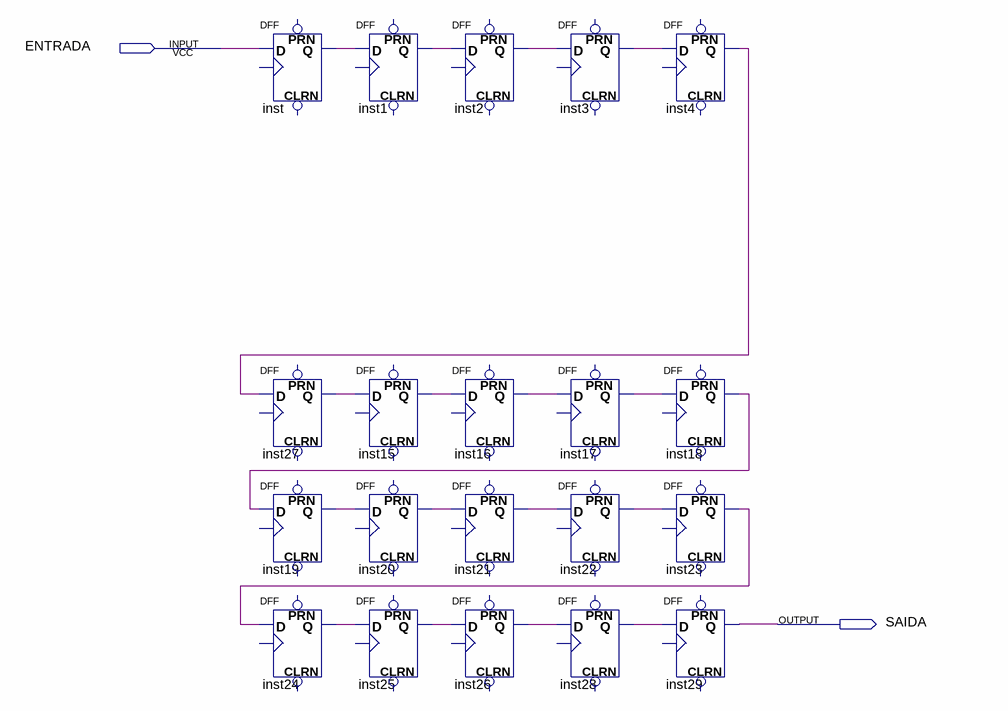
[diagram p0: schematic sheet]
// Quartus schematic temporizador.bdf as structural Verilog: 20 symbols, 2 pins
module temporizador (
  input  ENTRADA,
  output SAIDA
);

  wire inst1_q, inst2_q, inst3_q, inst4_q, inst15_q, inst16_q, inst17_q, inst18_q, inst19_q, inst20_q,
       inst21_q, inst22_q, inst23_q, inst24_q, inst25_q, inst26_q, inst27_q, inst28_q, inst_q;

  DFF inst (.D(ENTRADA), .Q(inst_q));  // open: CLRN, CLK, PRN
  DFF inst27 (.D(inst4_q), .Q(inst27_q));  // open: CLRN, CLK, PRN
  DFF inst19 (.D(inst18_q), .Q(inst19_q));  // open: CLRN, CLK, PRN
  DFF inst24 (.D(inst23_q), .Q(inst24_q));  // open: CLRN, CLK, PRN
  DFF inst1 (.D(inst_q), .Q(inst1_q));  // open: CLRN, CLK, PRN
  DFF inst15 (.D(inst27_q), .Q(inst15_q));  // open: CLRN, CLK, PRN
  DFF inst20 (.D(inst19_q), .Q(inst20_q));  // open: CLRN, CLK, PRN
  DFF inst25 (.D(inst24_q), .Q(inst25_q));  // open: CLRN, CLK, PRN
  DFF inst2 (.D(inst1_q), .Q(inst2_q));  // open: CLRN, CLK, PRN
  DFF inst16 (.D(inst15_q), .Q(inst16_q));  // open: CLRN, CLK, PRN
  DFF inst21 (.D(inst20_q), .Q(inst21_q));  // open: CLRN, CLK, PRN
  DFF inst26 (.D(inst25_q), .Q(inst26_q));  // open: CLRN, CLK, PRN
  DFF inst3 (.D(inst2_q), .Q(inst3_q));  // open: CLRN, CLK, PRN
  DFF inst17 (.D(inst16_q), .Q(inst17_q));  // open: CLRN, CLK, PRN
  DFF inst22 (.D(inst21_q), .Q(inst22_q));  // open: CLRN, CLK, PRN
  DFF inst28 (.D(inst26_q), .Q(inst28_q));  // open: CLRN, CLK, PRN
  DFF inst4 (.D(inst3_q), .Q(inst4_q));  // open: CLRN, CLK, PRN
  DFF inst18 (.D(inst17_q), .Q(inst18_q));  // open: CLRN, CLK, PRN
  DFF inst23 (.D(inst22_q), .Q(inst23_q));  // open: CLRN, CLK, PRN
  DFF inst29 (.D(inst28_q), .Q(SAIDA));  // open: CLRN, CLK, PRN
endmodule
